# EAGLE schematic NinjaPCB-2x2-MooMoo-logic_ver2.0 (EAGLE 6.6.0)
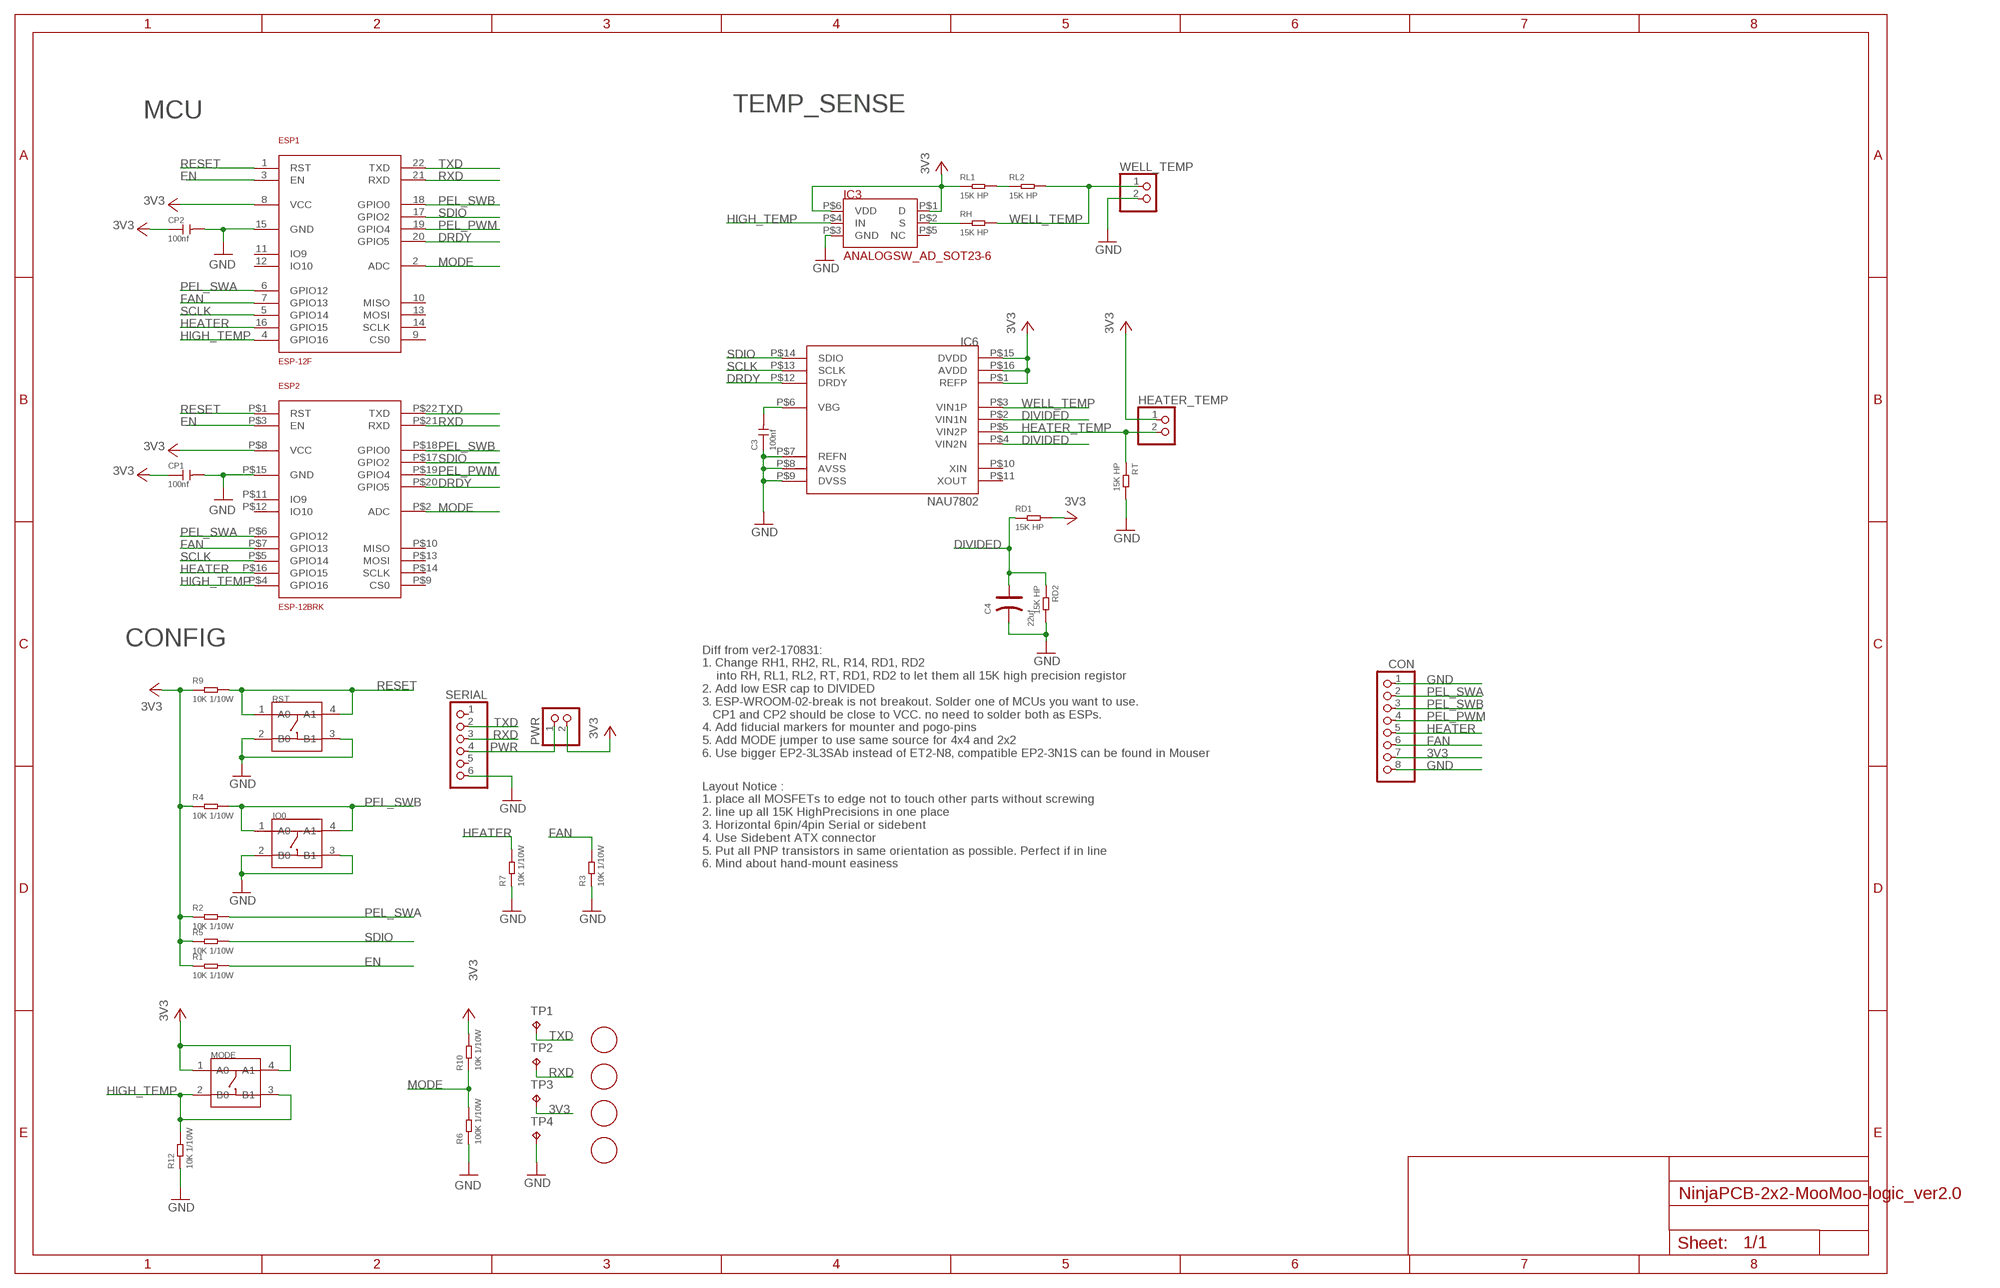
[diagram p0: schematic, sheet 1]

## Parts
C3  100nf  CERAMIC-100NF-50V-10%-X7R(0603)  [C0603]
C4  22uf  TANTALUM-SMD-22UF-16V(AVX-B)  [AVX-B]
CON  PINHD-1X8  [1X08]
CP1  100nf  CERAMIC-100NF-50V-10%-X7R(0603)  [C0603]
CP2  100nf  CERAMIC-100NF-50V-10%-X7R(0603)  [C0603]
ESP1  ESP-12F  [ESP-12F]
ESP2  ESP-12BRK  [ESP-12-BREAK]
HEATER_TEMP  PINHD-1X2  [1X02]
IC3  ANALOGSW_AD_SOT23-6  [SOT-23-6]
IC6  NAU7802  [SOP-16]
IO0  DIP-SWITCH-TACTILE-SPST-NO/TS-1109(4P-D6.0MM)'TS-1109'  [SW4-6.0X6.0X5.0MM]
MODE  DIP-SWITCH-TACTILE-SPST-NO/TS-1109(4P-D6.0MM)'TS-1109'  [SW4-6.0X6.0X5.0MM]
PWR  PINHD-1X2  [1X02]
R1  10K 1/10W  SMD-RES-10K-5%-1/10W(0603)  [R0603]
R2  10K 1/10W  SMD-RES-10K-5%-1/10W(0603)  [R0603]
R3  10K 1/10W  SMD-RES-10K-5%-1/10W(0603)  [R0603]
R4  10K 1/10W  SMD-RES-10K-5%-1/10W(0603)  [R0603]
R5  10K 1/10W  SMD-RES-10K-5%-1/10W(0603)  [R0603]
R6  100K 1/10W  SMD-RES-100K-5%-1/10W(0603)  [R0603]
R7  10K 1/10W  SMD-RES-10K-5%-1/10W(0603)  [R0603]
R9  10K 1/10W  SMD-RES-10K-5%-1/10W(0603)  [R0603]
R10  10K 1/10W  SMD-RES-10K-5%-1/10W(0603)  [R0603]
R12  10K 1/10W  SMD-RES-10K-5%-1/10W(0603)  [R0603]
RD1  15K HP  R0603  [R0603]
RD2  15K HP  R0603  [R0603]
RH  15K HP  R0603  [R0603]
RL1  15K HP  R0603  [R0603]
RL2  15K HP  R0603  [R0603]
RST  DIP-SWITCH-TACTILE-SPST-NO/TS-1109(4P-D6.0MM)'TS-1109'  [SW4-6.0X6.0X5.0MM]
RT  15K HP  SMD-RES-2K-1%-1/10W(0603)  [R0603]
SERIAL  PINHD-1X6  [1X06]
TP1  TPTP20R  [TP20R]
TP2  TPTP20R  [TP20R]
TP3  TPTP20R  [TP20R]
TP4  TPTP20R  [TP20R]
U$3  FIDUCIAL  [FIDUCIAL_1MM]
U$4  FIDUCIAL  [FIDUCIAL_1MM]
U$5  FIDUCIAL  [FIDUCIAL_1MM]
U$6  FIDUCIAL  [FIDUCIAL_1MM]
WELL_TEMP  PINHD-1X2  [1X02]

## Nets
3V3: CP1.1 CP2.1 ESP1.8(VCC) ESP2.P$8(VCC) HEATER_TEMP.1 IC3.P$1(D) IC3.P$6(VDD) IC6.P$1(REFP) IC6.P$15(DVDD) IC6.P$16(AVDD) MODE.1(A0) MODE.4(A1) PWR.2 R1.1 R2.1 R4.1 R5.1 R9.1 R10.2 RD1.2 RL1.1 TP3.TP
DIVIDED: C4.+ IC6.P$2(VIN1N) IC6.P$4(VIN2N) RD1.1 RD2.1
DRDY: ESP1.20(GPIO5) ESP2.P$20(GPIO5) IC6.P$12(DRDY)
EN: ESP1.3(EN) ESP2.P$3(EN) R1.2
FAN: ESP1.7(GPIO13) ESP2.P$7(GPIO13) R3.2
GND: C3.1 C4.- CON.1 CP1.2 CP2.2 ESP1.15(GND) ESP2.P$15(GND) IC3.P$3(GND) IC6.P$7(REFN) IC6.P$8(AVSS) IC6.P$9(DVSS) IO0.2(B0) IO0.3(B1) R3.1 R6.1 R7.1 R12.1 RD2.2 RST.2(B0) RST.3(B1) RT.2 SERIAL.6 TP4.TP WELL_TEMP.2
HEATER: ESP1.16(GPIO15) ESP2.P$16(GPIO15) R7.2
HEATER_TEMP: HEATER_TEMP.2 IC6.P$5(VIN2P) RT.1
HIGH_TEMP: ESP1.4(GPIO16) ESP2.P$4(GPIO16) IC3.P$4(IN) MODE.2(B0) MODE.3(B1) R12.2
MODE: ESP1.2(ADC) ESP2.P$2(ADC) R6.2 R10.1
N$1: RL1.2 RL2.1
N$27: IC3.P$2(S) RH.1
N$92: C3.2 IC6.P$6(VBG)
PEL_PWM: ESP1.19(GPIO4) ESP2.P$19(GPIO4)
PEL_SWA: ESP1.6(GPIO12) ESP2.P$6(GPIO12) R2.2
PEL_SWB: ESP1.18(GPIO0) ESP2.P$18(GPIO0) IO0.1(A0) IO0.4(A1) R4.2
PWR: PWR.1 SERIAL.4
RESET: ESP1.1(RST) ESP2.P$1(RST) R9.2 RST.1(A0) RST.4(A1)
RXD: ESP1.21(RXD) ESP2.P$21(RXD) SERIAL.3 TP2.TP
SCLK: ESP1.5(GPIO14) ESP2.P$5(GPIO14) IC6.P$13(SCLK)
SDIO: ESP1.17(GPIO2) ESP2.P$17(GPIO2) IC6.P$14(SDIO) R5.2
TXD: ESP1.22(TXD) ESP2.P$22(TXD) SERIAL.2 TP1.TP
WELL_TEMP: IC6.P$3(VIN1P) RH.2 RL2.2 WELL_TEMP.1
Unconnected: CON.2 CON.3 CON.4 CON.5 CON.6 CON.7 CON.8 ESP1.9(CS0) ESP1.10(MISO) ESP1.11(IO9) ESP1.12(IO10) ESP1.13(MOSI) ESP1.14(SCLK) ESP2.P$9(CS0) ESP2.P$10(MISO) ESP2.P$11(IO9) ESP2.P$12(IO10) ESP2.P$13(MOSI) ESP2.P$14(SCLK) IC3.P$5(NC) IC6.P$10(XIN) IC6.P$11(XOUT) SERIAL.1 SERIAL.5

## Notes on the sheet
- MCU | TEMP_SENSE
- CONFIG
- Diff from ver2-170831: 
  1. Change RH1, RH2, RL, R14, RD1, RD2 
      into RH, RL1, RL2, RT, RD1, RD2 to let them all 15K high precision registor
  2. Add low ESR cap to DIVIDED
  3. ESP-WROOM-02-break is not breakout. Solder one of MCUs you want to use.
     CP1 and CP2 should be close to VCC. no need to solder both as ESPs.
  4. Add fiducial markers for mounter and pogo-pins
  5. Add MODE jumper to use same source for 4x4 and 2x2
  6. Use bigger EP2-3L3SAb instead of ET2-N8, compatible EP2-3N1S can be found in Mouser
- Layout Notice :
  1. place all MOSFETs to edge not to touch other parts without screwing
  2. line up all 15K HighPrecisions in one place
  3. Horizontal 6pin/4pin Serial or sidebent
  4. Use Sidebent ATX connector
  5. Put all PNP transistors in same orientation as possible. Perfect if in line
  6. Mind about hand-mount easiness

## Library data of the parts
C3 CP1 CP2 = Seeed-Capacitor:CERAMIC-100NF-50V-10%-X7R(0603): 302010138; MPN: CC0603KRX7R9BB104
C4 = Seeed-Capacitor:TANTALUM-SMD-22UF-16V(AVX-B): 302020013; MPN: TAJB226*016#NJ
CON = pinhead:PINHD-1X8: PIN HEADER
ESP1 = Seeed-OPL-2017-01-Sensor-camilo:ESP-12F: 317060163
ESP2 = PCR-Module:ESP-12
HEATER_TEMP PWR WELL_TEMP = pinhead:PINHD-1X2: PIN HEADER
IC3 = PCR-IC:ANALOGSW_AD_SOT23-6
IC6 = PCR-IC:NAU7802
IO0 MODE RST = Seeed-Switch:DIP-SWITCH-TACTILE-SPST-NO/TS-1109(4P-D6.0MM): 311020024
R1-R5 R7 R9 R10 R12 = Seeed-Resistor:SMD-RES-10K-5%-1/10W(0603): 301010293; MPN: RC0603JR-0710KL
R6 = Seeed-Resistor:SMD-RES-100K-5%-1/10W(0603): 301010089; MPN: RC0603JR-07100KL
RD1 RD2 RH RL1 RL2 = PCR-RCL:R0603
RT = Seeed-Resistor:SMD-RES-2K-1%-1/10W(0603): 301010221; MPN: RC0603FR-072KL; VALUE: 2K
SERIAL = pinhead:PINHD-1X6: PIN HEADER
TP1-TP4 = testpad:TP: Test pad
U$3-U$6 = adafruit:FIDUCIAL: For use by pick and place machines to calibrate the vision/machine, 1mm By microbuilder.eu

## Net classes
1 2A: width 0.406 mm
2 8A: width 2.54 mm